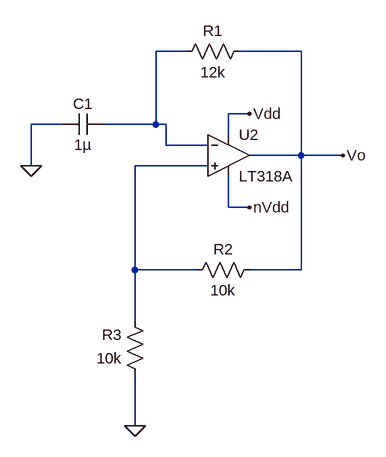
[diagram p0: schematic squarewavegenerator.asc]
squarewavegenerator.asc, the LTspice schematic file:
Version 4
SHEET 1 1056 680
WIRE 96 -80 48 -80
WIRE 272 -80 176 -80
WIRE 192 16 160 16
WIRE -96 32 -144 32
WIRE 48 32 48 -80
WIRE 48 32 -32 32
WIRE 64 32 48 32
WIRE 160 48 160 16
WIRE 64 64 64 32
WIRE 128 64 64 64
WIRE 272 80 272 -80
WIRE 272 80 192 80
WIRE 336 80 272 80
WIRE -144 96 -144 32
WIRE 128 96 16 96
WIRE 160 160 160 112
WIRE 192 160 160 160
WIRE 16 256 16 96
WIRE 112 256 16 256
WIRE 272 256 272 80
WIRE 272 256 192 256
WIRE 16 336 16 256
WIRE 16 496 16 416
FLAG -144 96 0
FLAG 16 496 0
FLAG 336 80 Vo
FLAG 192 16 Vdd
FLAG 192 160 nVdd
SYMBOL res 192 -96 R90
WINDOW 0 0 56 VBottom 2
WINDOW 3 32 56 VTop 2
SYMATTR InstName R1
SYMATTR Value 12k
SYMBOL res 208 240 R90
WINDOW 0 0 56 VBottom 2
WINDOW 3 32 56 VTop 2
SYMATTR InstName R2
SYMATTR Value 10k
SYMBOL res 32 432 R180
WINDOW 0 36 76 Left 2
WINDOW 3 36 40 Left 2
SYMATTR InstName R3
SYMATTR Value 10k
SYMBOL cap -32 16 R90
WINDOW 0 0 32 VBottom 2
WINDOW 3 32 32 VTop 2
SYMATTR InstName C1
SYMATTR Value 1µ
SYMBOL OpAmps\\LT318A 160 80 R0
SYMATTR InstName U2

The netlist it stands for:
* squarewavegenerator.asc
R1 Vo N001 12k
R2 Vo N002 10k
R3 0 N002 10k
C1 N001 0 1µ
* U2: LT318A (symbol OpAmps\LT318A not available, pins judged from their places): In+=N002 In-=N001 V+=Vdd V-=nVdd OUT=Vo
.backanno
.end